# Altium schematic sheet STM_MCU.SchDoc
size A4
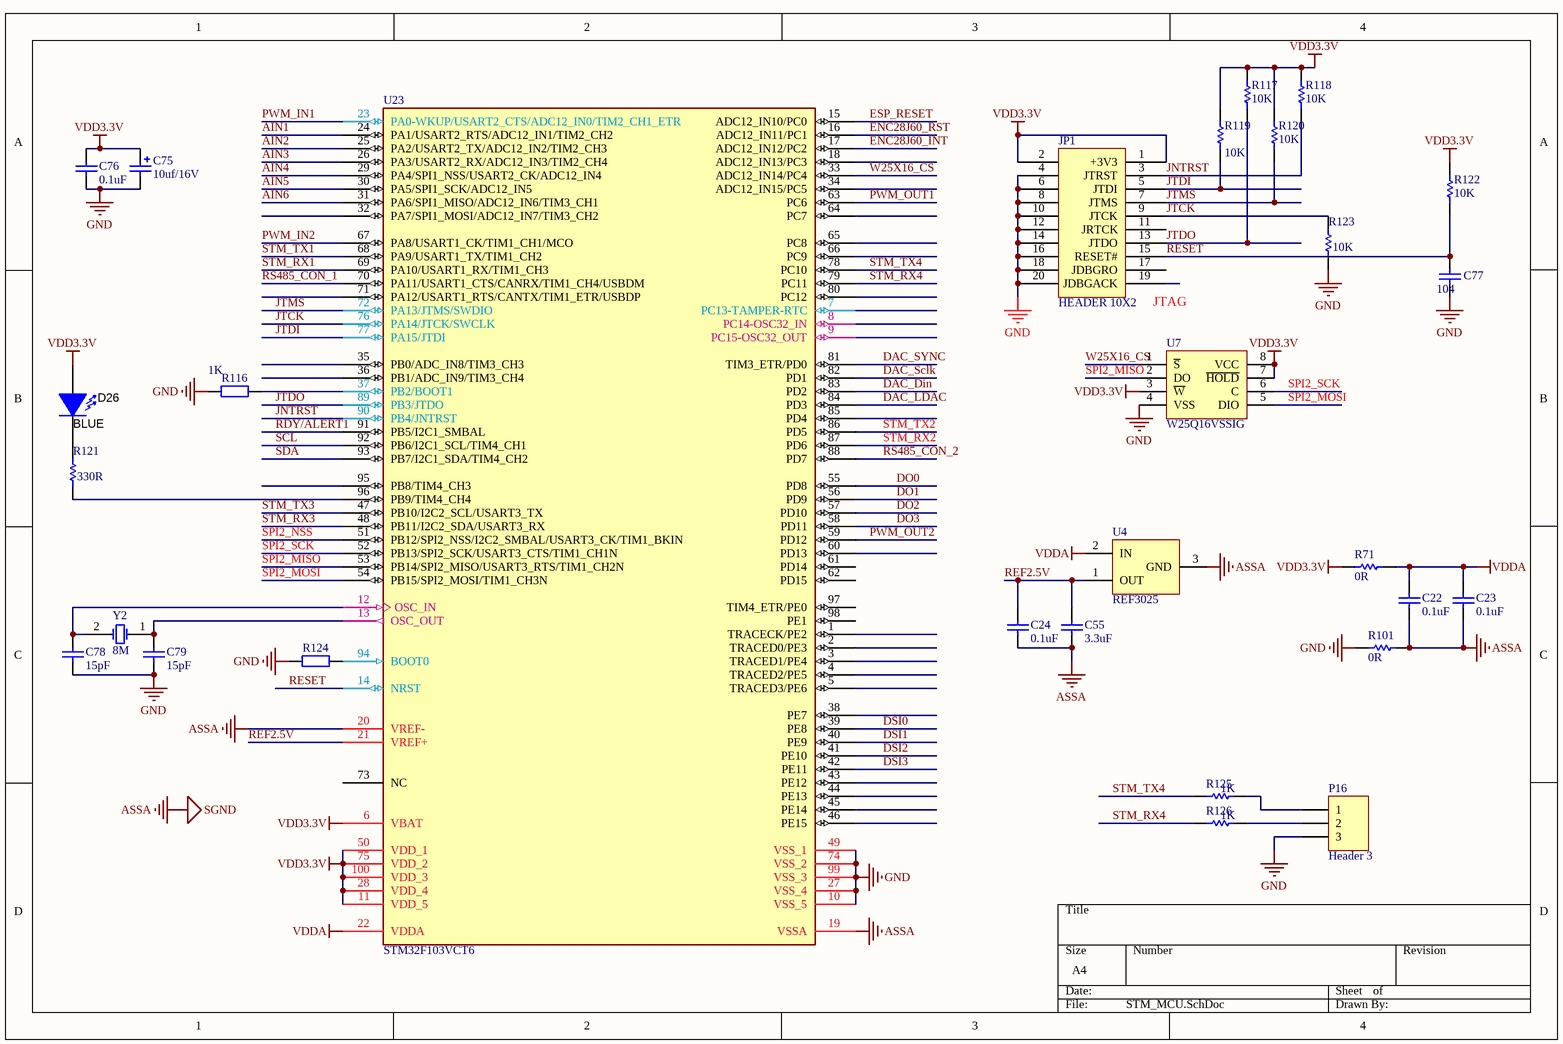
[diagram p0: STM_MCU.SchDoc]

## Parts
C22  value 0.1uF  [C0805]  (hidden comment: Cap)
C23  value 0.1uF  [C0805]  (hidden comment: Cap)
C24  0.1uF  [C0805]
C55  3.3uF  [C0805]
C75  value 10uf/16V  [C3216]
C76  value 0.1uF  [C0805]  (hidden comment: Cap)
C77  104  [C0805]
C78  value 15pF  [C0805]  (hidden comment: Cap)
C79  value 15pF  [C0805]  (hidden comment: Cap)
D26  value BLUE  [D0805]  (hidden comment: SML-P12YTT86)
JP1  HEADER 10X2  [STM32-JLINK]
P16  Header 3  [HDR1X3]
R71  value 0R  [0805]  (hidden comment: Res Semi)
R101  value 0R  [0805]  (hidden comment: Res Semi)
R116  value 1K  [0805]  (hidden comment: Res2)
R117  value 10K  [0805]  (hidden comment: Res Semi)
R118  value 10K  [0805]  (hidden comment: Res Semi)
R119  value 10K  [0805]  (hidden comment: Res Semi)
R120  value 10K  [0805]  (hidden comment: Res Semi)
R121  value 330R  [0805]  (hidden comment: Res Semi)
R122  10K  [0805]
R123  value 10K  [0805]  (hidden comment: Res Semi)
R124  Res2  [0805]  (value not drawn)
R125  value 1K  [0805]  (hidden comment: Res1)
R126  value 1K  [0805]  (hidden comment: Res1)
U4  REF3025  [SOT-23]
U7  W25Q16VSSIG  [wsop8]
U23  STM32F103VCT6  [LQFP100_M]
Y2  XTAL  [CY]  (value not drawn)

## Nets
ASSA: C22.1 C23.1 C24.1 C55.1 R101.2 U4.3(GND) U23.19(VSSA) U23.20(VREF-)  [also labelled SGND]
GND: C75.2 C76.1 C77.1 C78.1 C79.1 JP1.4 JP1.6 JP1.8 JP1.10 JP1.12 JP1.14 JP1.16 JP1.18 JP1.20 P16.3 R101.1 R116.1 R123.1 R124.1 U7.4(VSS) U23.10(VSS_5) U23.27(VSS_4) U23.49(VSS_1) U23.74(VSS_2) U23.99(VSS_3)
VDD3.3V: C75.1 C76.2 D26.1(A) JP1.1(+3V3) JP1.2 R71.1 R117.2 R118.2 R119.2 R120.2 R122.2 U7.3(~{W}) U7.7(~{HOLD}) U7.8(VCC) U23.6(VBAT) U23.11(VDD_5) U23.28(VDD_4) U23.50(VDD_1) U23.75(VDD_2) U23.100(VDD_3)
VDDA: C22.2 C23.2 R71.2 U4.2(IN) U23.22(VDDA)
AIN1: U23.24(PA1/USART2_RTS/ADC12_IN1/TIM2_CH2)
AIN2: U23.25(PA2/USART2_TX/ADC12_IN2/TIM2_CH3)
AIN3: U23.26(PA3/USART2_RX/ADC12_IN3/TIM2_CH4)
AIN4: U23.29(PA4/SPI1_NSS/USART2_CK/ADC12_IN4)
AIN5: U23.30(PA5/SPI1_SCK/ADC12_IN5)
AIN6: U23.31(PA6/SPI1_MISO/ADC12_IN6/TIM3_CH1)
DAC_Din: U23.83(PD2)
DAC_LDAC: U23.84(PD3)
DAC_Sclk: U23.82(PD1)
DAC_SYNC: U23.81(TIM3_ETR/PD0)
DO0: U23.55(PD8)
DO1: U23.56(PD9)
DO2: U23.57(PD10)
DO3: U23.58(PD11)
DSI0: U23.39(PE8)
DSI1: U23.40(PE9)
DSI2: U23.41(PE10)
DSI3: U23.42(PE11)
ENC28J60_INT: U23.17(ADC12_IN12/PC2)
ENC28J60_RST: U23.16(ADC12_IN11/PC1)
ESP_RESET: U23.15(ADC12_IN10/PC0)
JNTRST: JP1.3(JTRST) R118.1 U23.90(PB4/JNTRST)
JTCK: JP1.9(JTCK) R123.2 U23.76(PA14/JTCK/SWCLK)
JTDI: JP1.5(JTDI) R119.1 U23.77(PA15/JTDI)
JTDO: JP1.13(JTDO) R117.1 U23.89(PB3/JTDO)
JTMS: JP1.7(JTMS) R120.1 U23.72(PA13/JTMS/SWDIO)
PWM_IN1: U23.23(PA0-WKUP/USART2_CTS/ADC12_IN0/TIM2_CH1_ETR)
PWM_IN2: U23.67(PA8/USART1_CK/TIM1_CH1/MCO)
PWM_OUT1: U23.63(PC6)
PWM_OUT2: U23.59(PD12)
RDY/ALERT1: U23.91(PB5/I2C1_SMBAL)
REF2.5V: C24.2 C55.2 U4.1(OUT) U23.21(VREF+)
RESET: C77.2 JP1.15(RESET#) R122.1 U23.14(NRST)
RS485_CON_1: U23.70(PA11/USART1_CTS/CANRX/TIM1_CH4/USBDM)
RS485_CON_2: U23.88(PD7)
SCL: U23.92(PB6/I2C1_SCL/TIM4_CH1)
SDA: U23.93(PB7/I2C1_SDA/TIM4_CH2)
SPI2_MISO: U7.2(DO) U23.53(PB14/SPI2_MISO/USART3_RTS/TIM1_CH2N)
SPI2_MOSI: U7.5(DIO) U23.54(PB15/SPI2_MOSI/TIM1_CH3N)
SPI2_NSS: U23.51(PB12/SPI2_NSS/I2C2_SMBAL/USART3_CK/TIM1_BKIN)
SPI2_SCK: U7.6(C) U23.52(PB13/SPI2_SCK/USART3_CTS/TIM1_CH1N)
STM_RX1: U23.69(PA10/USART1_RX/TIM1_CH3)
STM_RX2: U23.87(PD6)
STM_RX3: U23.48(PB11/I2C2_SDA/USART3_RX)
STM_RX4: R126.1 U23.79(PC11)
STM_TX1: U23.68(PA9/USART1_TX/TIM1_CH2)
STM_TX2: U23.86(PD5)
STM_TX3: U23.47(PB10/I2C2_SCL/USART3_TX)
STM_TX4: R125.1 U23.78(PC10)
W25X16_CS: U7.1(~{S}) U23.33(ADC12_IN14/PC4)
NetC78_2: C78.2 U23.12(OSC_IN) Y2.2(OSC2)
NetC79_2: C79.2 U23.13(OSC_OUT) Y2.1(OSC1)
NetD26_2: D26.2(K) R121.2
NetP16_1: P16.1 R125.2
NetP16_2: P16.2 R126.2
NetR116_2: R116.2 U23.37(PB2/BOOT1)
NetR121_1: R121.1 U23.96(PB9/TIM4_CH4)
NetR124_2: R124.2 U23.94(BOOT0)

Not connected (* = marked no-connect by the designer): JP1 11(JRTCK) 17(JDBGRO) 19(JDBGACK); U23 1(TRACECK/PE2) 2(TRACED0/PE3) 3(TRACED1/PE4) 4(TRACED2/PE5) 5(TRACED3/PE6) 7(PC13-TAMPER-RTC) 8(PC14-OSC32_IN) 9(PC15-OSC32_OUT) 18(ADC12_IN13/PC3) 32(PA7/SPI1_MOSI/ADC12_IN7/TIM3_CH2) 34(ADC12_IN15/PC5) 35(PB0/ADC_IN8/TIM3_CH3) 36(PB1/ADC_IN9/TIM3_CH4) 38(PE7) 43(PE12) 44(PE13) 45(PE14) 46(PE15) 60(PD13) 61(PD14) 62(PD15) 64(PC7) 65(PC8) 66(PC9) 71(PA12/USART1_RTS/CANTX/TIM1_ETR/USBDP) 73(NC) 80(PC12) 85(PD4) 95(PB8/TIM4_CH3) 97(TIM4_ETR/PE0) 98(PE1)

## Notes on the sheet
- (near JP1) JTAG
- (in symbol XTAL) 8M

## Library data of the parts
C22 C23 C76 C77 = Cap_2: Capacitor; Published: 8-Jun-2000; LatestRevisionDate: 17-Jul-2002; LatestRevisionNote: Re-released for DXP Platform.; Publisher: Altium Limited
C24 C55 = Cap: Capacitor; Value: 100nF; Published: 8-Jun-2000; LatestRevisionDate: 17-Jul-2002; LatestRevisionNote: Re-released for DXP Platform.; PackageReference: RAD-0.3; Publisher: Altium Limited
C75 = Cap Pol2: Polarized Capacitor (Axial); Published: 8-Jun-2000; LatestRevisionDate: 17-Jul-2002; LatestRevisionNote: Re-released for DXP Platform.; PackageReference: POLAR0.8; Publisher: Altium Limited; PackageDescription: Polarized Capacitor; 2 Leads
C78 C79 = Cap: Capacitor; Published: 8-Jun-2000; LatestRevisionDate: 17-Jul-2002; LatestRevisionNote: Re-released for DXP Platform.; PackageReference: RAD-0.3; Publisher: Altium Limited
D26 = SML-P12YTT86: LED, GREEN SMD; Manufacturer: Rohm; Type: InGaN; Vf_V: 2.1; Value2: 2.1V; Io_A: 0.02; Tjmax_C: 85; Value1: W; Color: yellow; U/M: EA; CompType: LED; PartNumber: SML-P12YTT86; SymbolVersion: 2008-12-08; MountType: SMT; RoHS: Y; PackageReference: Yellow LED; Published: 2008-07-11; Publisher: Texas Instruments; ComponentLink1URL: http://rohmfs.rohm.com/en/products/databook/datasheet/opto/led/chip_mono/sml-p1.pdf; ComponentLink1Description: Datasheet link; LatestRevisionDate: 2013-06-24; LatestRevisionNote: Updated supplier queries; Supplier 1: Digi-Key; Supplier Part Number 1: 511-1595-1-ND; Supplier 2: Mouser; Supplier Part Number 2: 755-SML-P12YTT86; Supplier 3: Farnell; Supplier Part Number 3: 1973107
P16 = Header 3: Header, 3-Pin; LatestRevisionDate: 17-Jul-2002; LatestRevisionNote: Re-released for DXP Platform.; Publisher: Altium Limited
R71 R101 R117-R123 = Res Semi: Semiconductor Resistor; Published: 8-Jun-2000; LatestRevisionDate: 17-Jul-2002; LatestRevisionNote: Re-released for DXP Platform.; PackageReference: AXIAL-0.5; Publisher: Altium Limited
  R122: Value: 10K
R116 = RES
R124 = RES: Value: 10K
R125 R126 = Res1: Resistor; Published: 8-Jun-2000; LatestRevisionDate: 17-Jul-2002; LatestRevisionNote: Re-released for DXP Platform.; PackageReference: AXIAL-0.3; Publisher: Altium Limited
U4 = REF3012
U7 = A25L080
U23 = STM32F103VBT6: STM32 ARM-based 32-bit MCU with 64 Kbytes Flash, 100-pin LQFP, Industrial Temperature; Published: *; DatasheetVersion: *; PackageVersion: *; PackageReference: *; Publisher: *; PackageDescription: *; ComponentLink1Description: *; ComponentLink1URL: *; ComponentLink2Description: *; ComponentLink2URL: *
Y2 = XTAL: Crystal Oscillator; Published: 8-Jun-2000; LatestRevisionDate: 17-Jul-2002; LatestRevisionNote: Re-released for DXP Platform.; PackageReference: R38; Publisher: Altium Limited